# EAGLE design pm8fios (EAGLE 4.11)
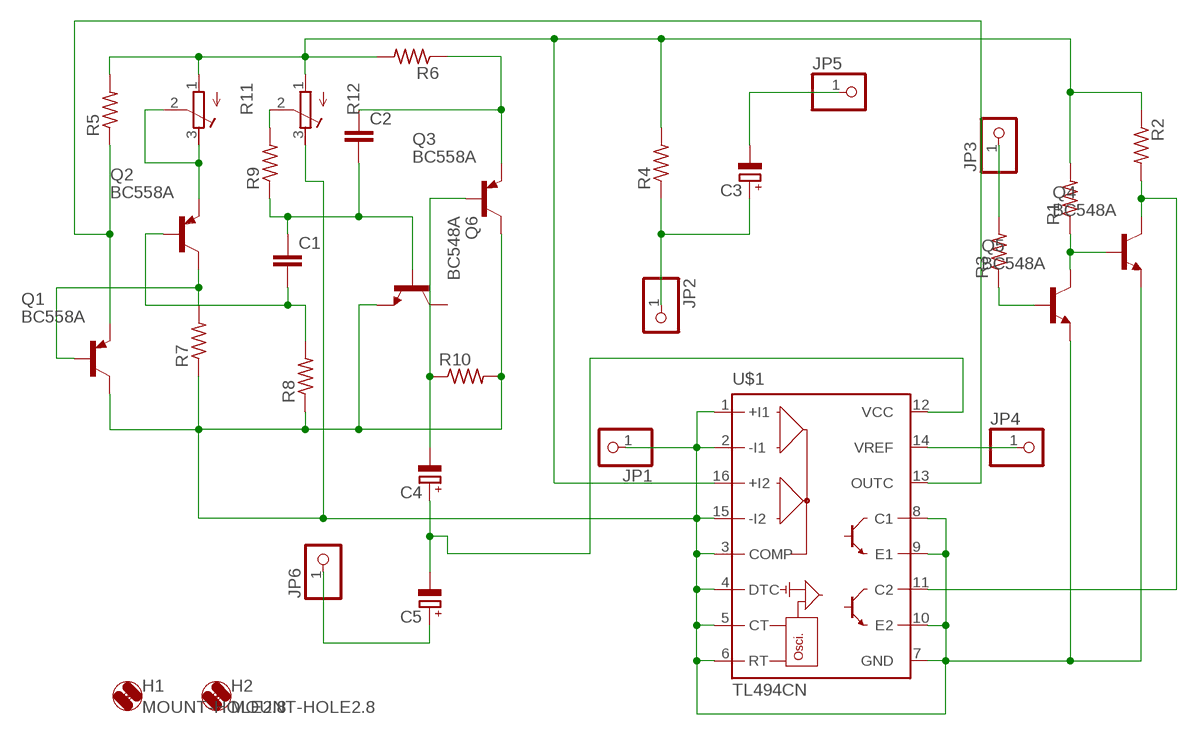
[diagram p0: schematic, sheet 1]

## Parts
C1  C-EU050-025X075  [C050-025X075]
C2  C-EU050-025X075  [C050-025X075]
C3  CPOL-EUE5-8.5  [E5-8,5]
C4  CPOL-EUE5-8.5  [E5-8,5]
C5  CPOL-EUE5-8.5  [E5-8,5]
H1  MOUNT-HOLE2.8  [2,8]
H2  MOUNT-HOLE2.8  [2,8]
JP1  PINHD-1X1  [1X01]
JP2  PINHD-1X1  [1X01]
JP3  PINHD-1X1  [1X01]
JP4  PINHD-1X1  [1X01]
JP5  PINHD-1X1  [1X01]
JP6  PINHD-1X1  [1X01]
Q1  BC558A  [TO92-EBC]
Q2  BC558A  [TO92-EBC]
Q3  BC558A  [TO92-EBC]
Q4  BC548A  [TO92-EBC]
Q5  BC548A  [TO92-EBC]
Q6  BC548A  [TO92-EBC]
R1  R-US_0204/5  [0204/5]
R2  R-US_0204/5  [0204/5]
R3  R-US_0204/5  [0204/5]
R4  R-US_0204/5  [0204/5]
R5  R-US_0204/5  [0204/5]
R6  R-US_0204/5  [0204/5]
R7  R-US_0204/5  [0204/5]
R8  R-US_0204/5  [0204/5]
R9  R-US_0204/5  [0204/5]
R10  R-US_0204/5  [0204/5]
R11  R-TRIMM3339P  [RTRIM3339P]
R12  R-TRIMM3339P  [RTRIM3339P]
U$1  TL494CN  [DIL16]

## Nets
N$1: JP1.1 Q1.C Q3.C Q4.E Q5.E Q6.E R7.1 R8.1 R10.2 R12.3(A) U$1.1(+I1) U$1.2(-I1) U$1.3(COMP) U$1.4(DTC) U$1.5(CT) U$1.6(RT) U$1.7(GND) U$1.8(C1) U$1.9(E1) U$1.10(E2) U$1.15(-I2)
N$2: C3.+ JP2.1 R4.1
N$3: C3.- JP5.1
N$4: Q4.B Q5.C R1.1
N$5: R1.2 R2.1 R4.2 R5.2 R6.2 R11.1(E) R12.1(E) U$1.16(+I2)
N$6: Q4.C R2.2 U$1.11(C2)
N$7: Q1.E R5.1 U$1.13(OUTC)
N$8: Q5.B R3.1
N$9: JP3.1 R3.2
N$11: Q2.E R11.2(S) R11.3(A)
N$12: JP4.1 U$1.14(VREF)
N$13: Q1.B Q2.C R7.2
N$15: C1.2 Q2.B R8.2
N$16: C4.- Q3.B R10.1
N$17: R9.2 R12.2(S)
N$18: C1.1 C2.2 Q6.B R9.1
N$19: C4.+ C5.- U$1.12(VCC)
N$20: C5.+ JP6.1
N$22: C2.1 Q3.E R6.1
Unconnected: Q6.C

## Library data of the parts
C1 C2 = rcl:C-EU: CAPACITOR, European symbol
C3-C5 = rcl:CPOL-EU: POLARIZED CAPACITOR, European symbol
H1 H2 = holes:MOUNT-HOLE: MOUNTING HOLE with drill center marker
JP1-JP6 = pinhead:PINHD-1X1: PIN HEADER
Q1-Q3 = transistor-pnp:BC558*: PNP Transistror
Q4-Q6 = transistor-npn:BC548*: NPN Transistor
R1-R10 = rcl:R-US_: RESISTOR, American symbol
R11 R12 = rcl:R-TRIMM: Trimm resistor
U$1 = linear:TL494*: SWITCHMODE Pulse Width Modulation Control Circuit NCV494B http://onsemi.com tl494-d.pdf

## Board
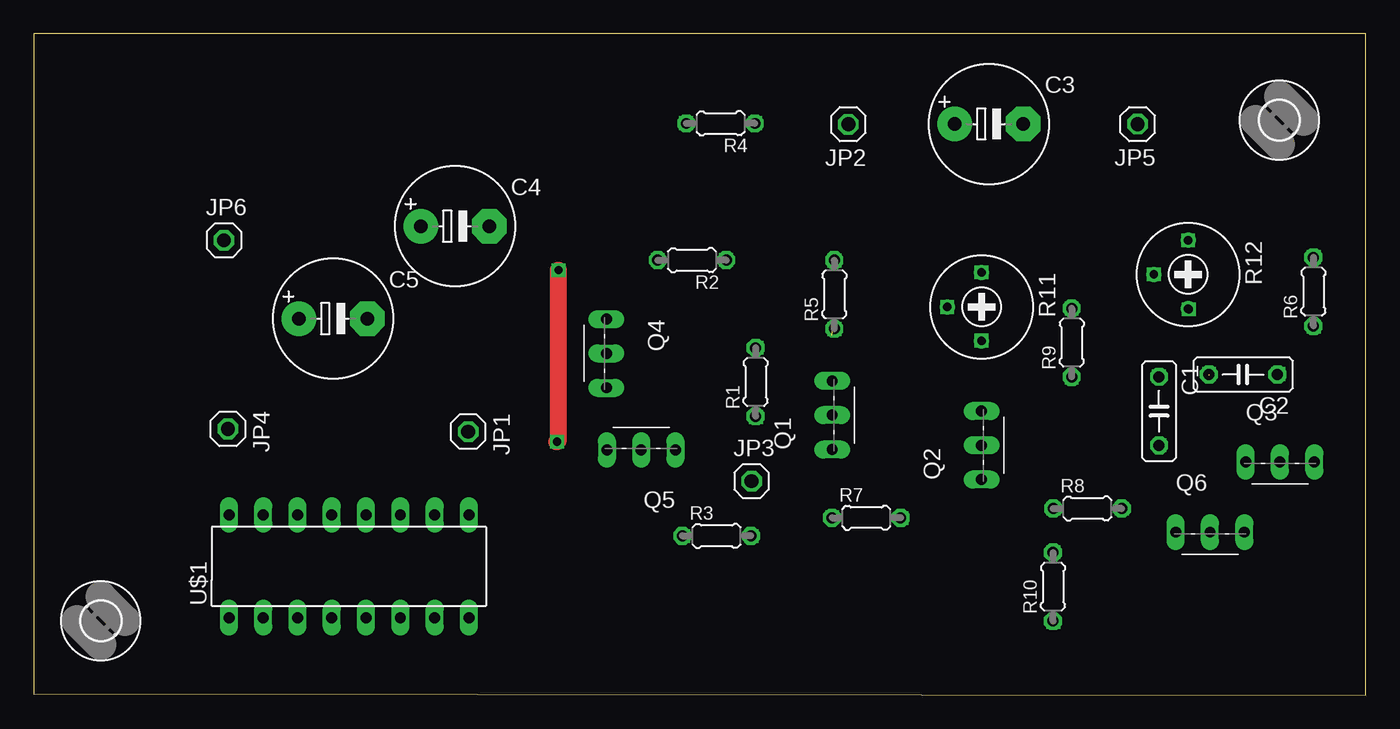
[diagram p1: board, top side]
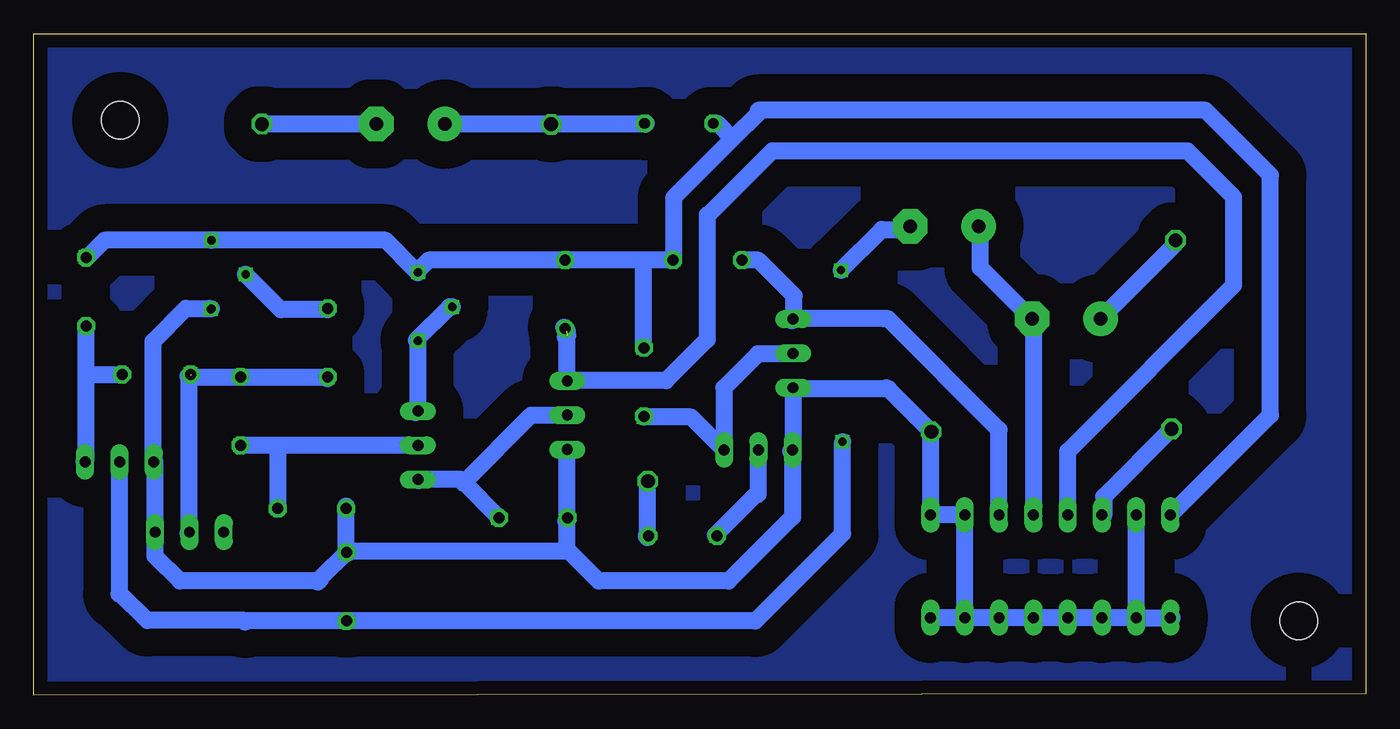
[diagram p2: board, bottom side, seen from below]

Size 98.74 x 49.05 mm. Coordinates in mm from the lower left corner, seen from the top.
Outline: 0,0.11 98.74,0 98.74,49.05 0,49.05 0,0.11
Copper layers (1*16): Top 0.035mm / dielectric 1.5mm / Bottom 0.035mm
Design rules "default": minimum track width 10mil, minimum drill 24mil, track to track 80mil, track to pad 80mil, pad to pad 80mil, via to via 80mil, smd to smd 80mil, copper to edge 40mil, drill to drill 8mil, minimum pad ring 10mil, minimum via ring 8mil, stop-mask expansion 4mil, vias tented up to drill 0mil, thermal gap 10mil

### Footprints (pad centres in the part's own frame; a part is rotated, then mirrored left to right if it is on the bottom)
C050-025X075 = drill 0.813 octagon: 1 -2.54,0; 2 2.54,0
E5-8,5 = drill 1.016 pad 2.54 round: + -2.54,0 | drill 1.016 pad 2.54 octagon: - 2.54,0
2,8 = hole 2.8: 0,0
1X01 = drill 1.016 octagon: 1 0,0
TO92-EBC = drill 0.813 long: B 0,-1.27; C -2.54,-1.27; E 2.54,-1.27
0204/5 = drill 0.813 octagon: 1 -2.54,0; 2 2.54,0
RTRIM3339P = drill 0.61 round: 1 -2.54,0; 2 0,-2.54; 3 2.54,0
DIL16 = drill 0.813 long: 1 -8.89,-3.81; 2 -6.35,-3.81; 3 -3.81,-3.81; 4 -1.27,-3.81; 5 1.27,-3.81; 6 3.81,-3.81; 7 6.35,-3.81; 8 8.89,-3.81; 9 8.89,3.81; 10 6.35,3.81; 11 3.81,3.81; 12 1.27,3.81; 13 -1.27,3.81; 14 -3.81,3.81; 15 -6.35,3.81; 16 -8.89,3.81

### Placement (x,y rotation side)
C1  83.42,21.07 270 top
C2  89.65,23.78 180 top
C3  70.81,42.36 0 top
C4  31.23,34.78 0 top
C5  22.19,27.92 0 top
H1  4.98,5.52 0 top
H2  92.34,42.64 0 top
JP1  32.2,19.54 270 top
JP2  60.39,42.34 180 top
JP3  53.21,15.88 0 top
JP4  14.4,19.74 270 top
JP5  81.84,42.35 180 top
JP6  14.1,33.74 0 top
Q1  57.92,20.76 90 top
Q2  68.99,18.53 90 top
Q3  92.39,18.57 0 top
Q4  43.72,25.34 270 top
Q5  45.03,16.92 180 top
Q6  87.2,13.36 0 top
R1  53.51,23.22 90 top
R2  48.8,32.26 180 top
R3  50.62,11.81 0 top
R4  50.91,42.4 180 top
R5  59.34,29.72 90 top
R6  94.86,29.92 90 top
R7  61.71,13.16 0 top
R8  78.12,13.84 0 top
R9  76.94,26.15 90 top
R10  75.55,8.04 90 top
R11  70.27,28.79 270 top
R12  85.58,31.2 270 top
U$1  23.37,9.55 0 top

### Tracks (layer width: path | path; a pad name or v marks a point on that pad's centre or on a via)
N$1
  Bottom 1.27: 75.49,10.65 75.46,10.62 75.52,10.56 75.56,10.59 R10.2 | R10.2 75.49,10.65 | 75.49,10.65 | 75.49,10.65 75.58,10.73 75.58,14.01 | 75.49,10.65 75.46,10.68 | 75.49,10.65 | 75.49,10.65 77.49,8.65 77.49,8.56 77.67,8.38 77.76,8.47 87.9,8.47 89.74,10.31 Q6.E 89.74,17.33 89.85,17.44 | R10.2 75.53,10.58 75.47,10.52 75.32,10.67 59.34,10.67 59.2,10.81 | 29.72,13.45 U$1.10 32.2,13.36 32.22,13.35 32.24,13.36 U$1.9 32.23,13.34 | U$1.7 29.72,13.45 | 29.72,13.45 29.79,13.52 | 29.67,5.74 U$1.7 | U$1.7 U$1.8 | 29.67,5.74 29.62,5.8 | U$1.7 29.72,5.73 29.7,5.71 29.67,5.74 | 29.67,5.74 U$1.6 27.18,5.72 | 27.18,5.72 27.19,5.71 | 24.76,5.74 27.15,5.74 27.18,5.72 | 24.76,5.74 U$1.5 | 24.76,5.74 24.76,5.62 U$1.5 U$1.4 22.07,5.71 22.03,5.74 19.64,5.74 | 19.64,5.74 U$1.3 | 19.64,5.74 19.64,5.8 19.58,5.74 17.21,5.74 | 17.21,5.74 U$1.2 17.02,5.73 | U$1.1 14.38,5.74 14.34,5.71 17.03,5.71 | 17.21,5.74 17.21,5.8 17.12,5.71 17.03,5.71 | 17.02,5.73 U$1.15 | 17.03,5.71 17.02,5.73 | 75.58,14.01 R8.1 | 75.58,14.01 75.59,14.02 | 89.85,17.44 89.9,17.49 89.9,26.24 87.47,28.67 85.73,28.67 85.72,28.66 R12.3 | 89.85,17.44 Q3.C | 42.49,18.09 42.49,13.21 47.23,8.47 56.86,8.47 59.2,10.81 | 42.49,18.09 Q5.E | R7.1 59.19,13.16 59.2,13.15 59.2,12.89 | 59.2,10.81 59.2,12.89 | 59.2,12.89 59.29,12.89 59.19,12.99 Q1.C | 42.49,18.09 42.64,18.09 42.45,18.28 42.45,22.71 | 42.45,22.71 Q4.E | 32.23,13.34 32.23,13.23 | 32.23,13.34 32.23,19.51 JP1.1 35.37,22.71 35.48,22.71 35.56,22.78 35.63,22.71 42.45,22.71 | 42.45,22.71 42.46,22.71
N$2
  Bottom 1.27: 53.35,42.4 53.34,42.4 | R4.1 53.35,42.4 | 53.35,42.4 53.41,42.34 JP2.1 60.39,42.23 | 60.39,42.23 60.35,42.19 | C3.+ 60.52,42.36 60.39,42.23
N$3
  Bottom 1.27: C3.- 73.35,42.34 73.4,42.3 73.45,42.35 JP5.1
N$4
  Bottom 1.27: R1.1 53.52,20.62 50.01,20.62 Q5.C 47.58,22.79 45.07,25.31 42.48,25.31 Q4.B
N$5
  Bottom 1.27: 70.3,31.45 70.27,31.41 R11.1 | 70.3,31.45 69.49,32.26 R5.2 59.33,32.27 53.56,32.27 | 70.3,31.45 70.39,31.45 72.68,33.74 R12.1 93.5,33.74 94.78,32.46 R6.2 | 53.56,32.27 R2.1 51.32,32.29 51.32,36.89 46.93,41.27 | R1.2 53.56,25.81 53.56,32.27 | U$1.16 7.07,20.77 7.07,38.57 11.88,43.38 45.04,43.38 45.04,43.37 45,43.33 | 45,43.33 44.94,43.38 | 45,43.33 | 45,43.33 45,43.21 46.93,41.27 | 46.93,41.27 | R4.2 48.06,42.4 46.93,41.27
N$6
  Bottom 1.27: U$1.11 27.18,19.68 35.42,27.92 35.62,27.92 35.66,27.96 35.71,27.92 42.38,27.92 42.45,27.85 | 42.45,27.85 42.54,27.76 | 42.45,27.85 Q4.C 42.42,27.88 42.39,27.92 42.39,29.63 45.02,32.26 R2.2
N$7  (1 unrouted)
  Bottom 1.27: 59.32,26.53 59.17,26.69 | R5.1 59.46,27.29 | R5.1 | R5.1 59.19,27.02 Q1.E 59.27,23.3 | U$1.13 22.1,18.09 9.79,30.4 9.79,36.93 13.21,40.35 43.85,40.35 43.86,40.36 43.87,40.35 44.01,40.35 48.75,35.61 48.83,35.61 48.83,26.36 51.86,23.33 59.24,23.33 59.27,23.3 | 59.27,23.3 59.32,23.25
N$8
  Bottom 1.27: R3.1 48.15,11.81 48.22,11.88 45.14,14.96 | 45.14,14.96 45.03,15.07 45.07,15.1 | 45.14,14.96 45.07,14.89 45.03,14.92 Q5.B | 45.14,14.96
N$9
  Bottom 1.27: 53.32,11.81 53.35,11.79 | R3.2 53.26,11.81 | 53.26,11.81 53.3,11.81 | 53.3,11.81 53.32,11.81 | 53.32,11.81 53.21,11.92 | 53.3,11.81 53.3,11.76 53.21,11.85 | 53.26,11.81 53.26,11.68 | JP3.1 53.26,15.83 53.26,11.81
N$10  (via drill 0.61)
  other vias: 14.17,33.74
N$11
  Bottom 1.27: 70.36,21.07 70.47,20.96 | Q2.E 70.36,21.07 | 70.36,21.07 70.27,21.16 R11.3 70.31,26.25 70.39,26.33 67.92,28.79 R11.2
N$12
  Bottom 1.27: 19.57,13.38 U$1.14 19.5,13.31 19.42,13.31 19.42,14.72 JP4.1
N$13
  Bottom 1.27: Q2.C 70.26,15.93 70.25,15.92 70.19,15.98 67.01,15.98 | 67.01,15.98 66.76,15.98 | 67.01,15.98 67.01,15.92 66.86,15.77 | R7.2 66.86,15.77 | 66.86,15.77 66.9,15.72 | 66.86,15.77 | Q1.B 61.86,20.76 66.86,15.77
N$14  (via drill 0.61)
  other vias: 19.67,27.91
N$15
  Bottom 1.27: C1.2 83.42,18.58 83.4,18.59 83.34,18.53 80.67,18.53 | Q2.B 80.67,18.53 | 80.67,18.53 80.67,18.4 80.66,18.39 R8.2
N$16  (via drill 0.61)
  Top 1.27: v38.79,18.8 38.9,18.9 v38.9,31.52
  Bottom 1.27: 92.36,7.57 90.33,5.54 83.09,5.54 | 92.36,7.57 92.39,7.6 | 83.09,5.54 | 83.09,5.54 83.09,5.44 83.03,5.5 R10.1 45.26,5.5 38.79,11.97 v38.79,18.8 | 92.36,7.57 92.39,7.54 | 92.36,7.57 | 92.39,7.54 Q3.B | 92.39,7.54 92.41,7.51 | C4.- 33.73,34.73 33.73,34.54 35.88,34.54 v38.9,31.52
N$17
  Bottom 1.27: R9.2 76.98,28.66 76.98,28.59 80.42,28.59 R12.2
N$18  (1 unrouted)
  Bottom 1.27: R9.1 76.94,23.52 76.99,23.48 77.11,23.61 C1.1 87.21,23.61 | 87.09,23.61 87.21,23.61 | 87.09,23.61 87.07,23.6 | 87.09,23.61 87.09,23.64 | 87.09,23.64 87.09,23.67 87.11,23.7 | 87.21,23.61 87.22,23.61 | 87.21,23.61 87.2,23.6 | 87.09,23.64 87.29,23.64 87.26,23.61 87.21,23.61 | 87.23,12.09 87.29,12.02 | Q6.B 87.23,12.09 | 87.21,23.61 87.21,12.11 87.23,12.09
N$19
  Bottom 1.27: C5.- 24.73,27.77 24.65,27.77 | 24.62,13.35 24.62,13.23 | U$1.12 24.62,13.35 | 24.65,27.77 24.62,27.74 24.62,13.35 | C4.+ 28.67,34.75 28.58,34.75 28.58,31.7 24.65,27.77
N$20
  Bottom 1.27: JP6.1 14.17,33.75 14.17,33.4 C5.+
N$21  (via drill 0.61)
  other vias: 24.68,27.91
N$22
  Bottom 1.27: Q3.E 95,17.3 95.01,17.31 94.86,17.47 94.86,23.82 | 94.86,23.82 R6.1 | 94.86,23.82 94.75,23.82 94.71,23.78 C2.1
N$23  (via drill 0.61)
  other vias: 28.67,34.81
N$24  (via drill 0.61)
  other vias: 33.8,34.81
N$25  (via drill 0.61)
  other vias: 32.18,19.56
N$26  (via drill 0.61)
  other vias: 14.38,19.72
N$27  (via drill 0.61)
  other vias: 14.43,13.36
N$28  (via drill 0.61)
  other vias: 17.02,13.36
N$29  (via drill 0.61)
  other vias: 19.56,13.36
N$30  (via drill 0.61)
  other vias: 22.09,13.3
N$31  (via drill 0.61)
  other vias: 24.63,13.41
N$32  (via drill 0.61)
  other vias: 27.16,13.36
N$33  (via drill 0.61)
  other vias: 29.75,13.36
N$34  (via drill 0.61)
  other vias: 32.29,13.41
N$35  (via drill 0.61)
  other vias: 32.34,5.75
N$36  (via drill 0.61)
  other vias: 29.75,5.75
N$37  (via drill 0.61)
  other vias: 27.16,5.7
N$38  (via drill 0.61)
  other vias: 24.63,5.75
N$39  (via drill 0.61)
  other vias: 22.09,5.75
N$40  (via drill 0.61)
  other vias: 19.56,5.7
N$41  (via drill 0.61)
  other vias: 17.02,5.7
N$42  (via drill 0.61)
  other vias: 14.49,5.7
N$43  (via drill 0.61)
  other vias: 42.53,18.15
N$44  (via drill 0.61)
  other vias: 45.07,18.21
N$45  (via drill 0.61)
  other vias: 47.6,18.21
N$46  (via drill 0.61)
  other vias: 48.14,11.79
N$47  (via drill 0.61)
  other vias: 42.48,22.79
N$48  (via drill 0.61)
  other vias: 42.48,25.33
N$49  (via drill 0.61)
  other vias: 42.42,27.91
N$50  (via drill 0.61)
  other vias: 46.25,32.28
N$51  (via drill 0.61)
  other vias: 51.32,32.28
N$52  (via drill 0.61)
  other vias: 59.36,32.23
N$53  (via drill 0.61)
  other vias: 59.36,27.16
N$54  (via drill 0.61)
  other vias: 59.25,23.33
N$55  (via drill 0.61)
  other vias: 53.59,25.76
N$56  (via drill 0.61)
  other vias: 53.53,20.64
N$57  (via drill 0.61)
  other vias: 59.2,20.8
N$58  (via drill 0.61)
  other vias: 59.2,18.21
N$59  (via drill 0.61)
  other vias: 70.25,31.36
N$60  (via drill 0.61)
  other vias: 70.25,26.3
N$61  (via drill 0.61)
  other vias: 67.72,28.78
N$62  (via drill 0.61)
  other vias: 85.57,33.74
N$63  (via drill 0.61)
  other vias: 85.62,28.61
N$64  (via drill 0.61)
  other vias: 83.03,31.2
N$65  (via drill 0.61)
  other vias: 76.94,28.67
N$66  (via drill 0.61)
  other vias: 76.94,23.55
N$67  (via drill 0.61)
  other vias: 83.41,23.65
N$68  (via drill 0.61)
  other vias: 83.46,18.53
N$69  (via drill 0.61)
  other vias: 87.13,23.82
N$70  (via drill 0.61)
  other vias: 92.26,23.82
N$71  (via drill 0.61)
  other vias: 94.9,32.5
N$72  (via drill 0.61)
  other vias: 94.9,27.32
N$73  (via drill 0.61)
  other vias: 94.95,17.35
N$74  (via drill 0.61)
  other vias: 92.42,17.35
N$75  (via drill 0.61)
  other vias: 89.88,17.35
N$76  (via drill 0.61)
  other vias: 89.77,12.12
N$77  (via drill 0.61)
  other vias: 87.19,12.12
N$78  (via drill 0.61)
  other vias: 84.71,12.06
N$79  (via drill 0.61)
  other vias: 75.59,13.84
N$80  (via drill 0.61)
  other vias: 80.66,13.84
N$81  (via drill 0.61)
  other vias: 75.59,10.61
N$82  (via drill 0.61)
  other vias: 75.59,5.43
N$83  (via drill 0.61)
  other vias: 70.25,16
N$84  (via drill 0.61)
  other vias: 70.25,18.59
N$85  (via drill 0.61)
  other vias: 70.25,21.12
N$86  (via drill 0.61)
  other vias: 53.21,11.79
N$87  (via drill 0.61)
  other vias: 53.21,15.84
N$88  (via drill 0.61)
  other vias: 59.2,13.19
N$89  (via drill 0.61)
  other vias: 64.32,13.14
N$90  (via drill 0.61)
  other vias: 60.38,42.36
N$91  (via drill 0.61)
  other vias: 53.48,42.42
N$92  (via drill 0.61)
  other vias: 48.36,42.42
N$93  (via drill 0.61)
  other vias: 68.26,42.31
N$94
  pour Bottom: -0.02,0.26 98.2,0.26 98.42,49.01 0.2,48.79